# EAGLE design CortexPrint (EAGLE 6.4)
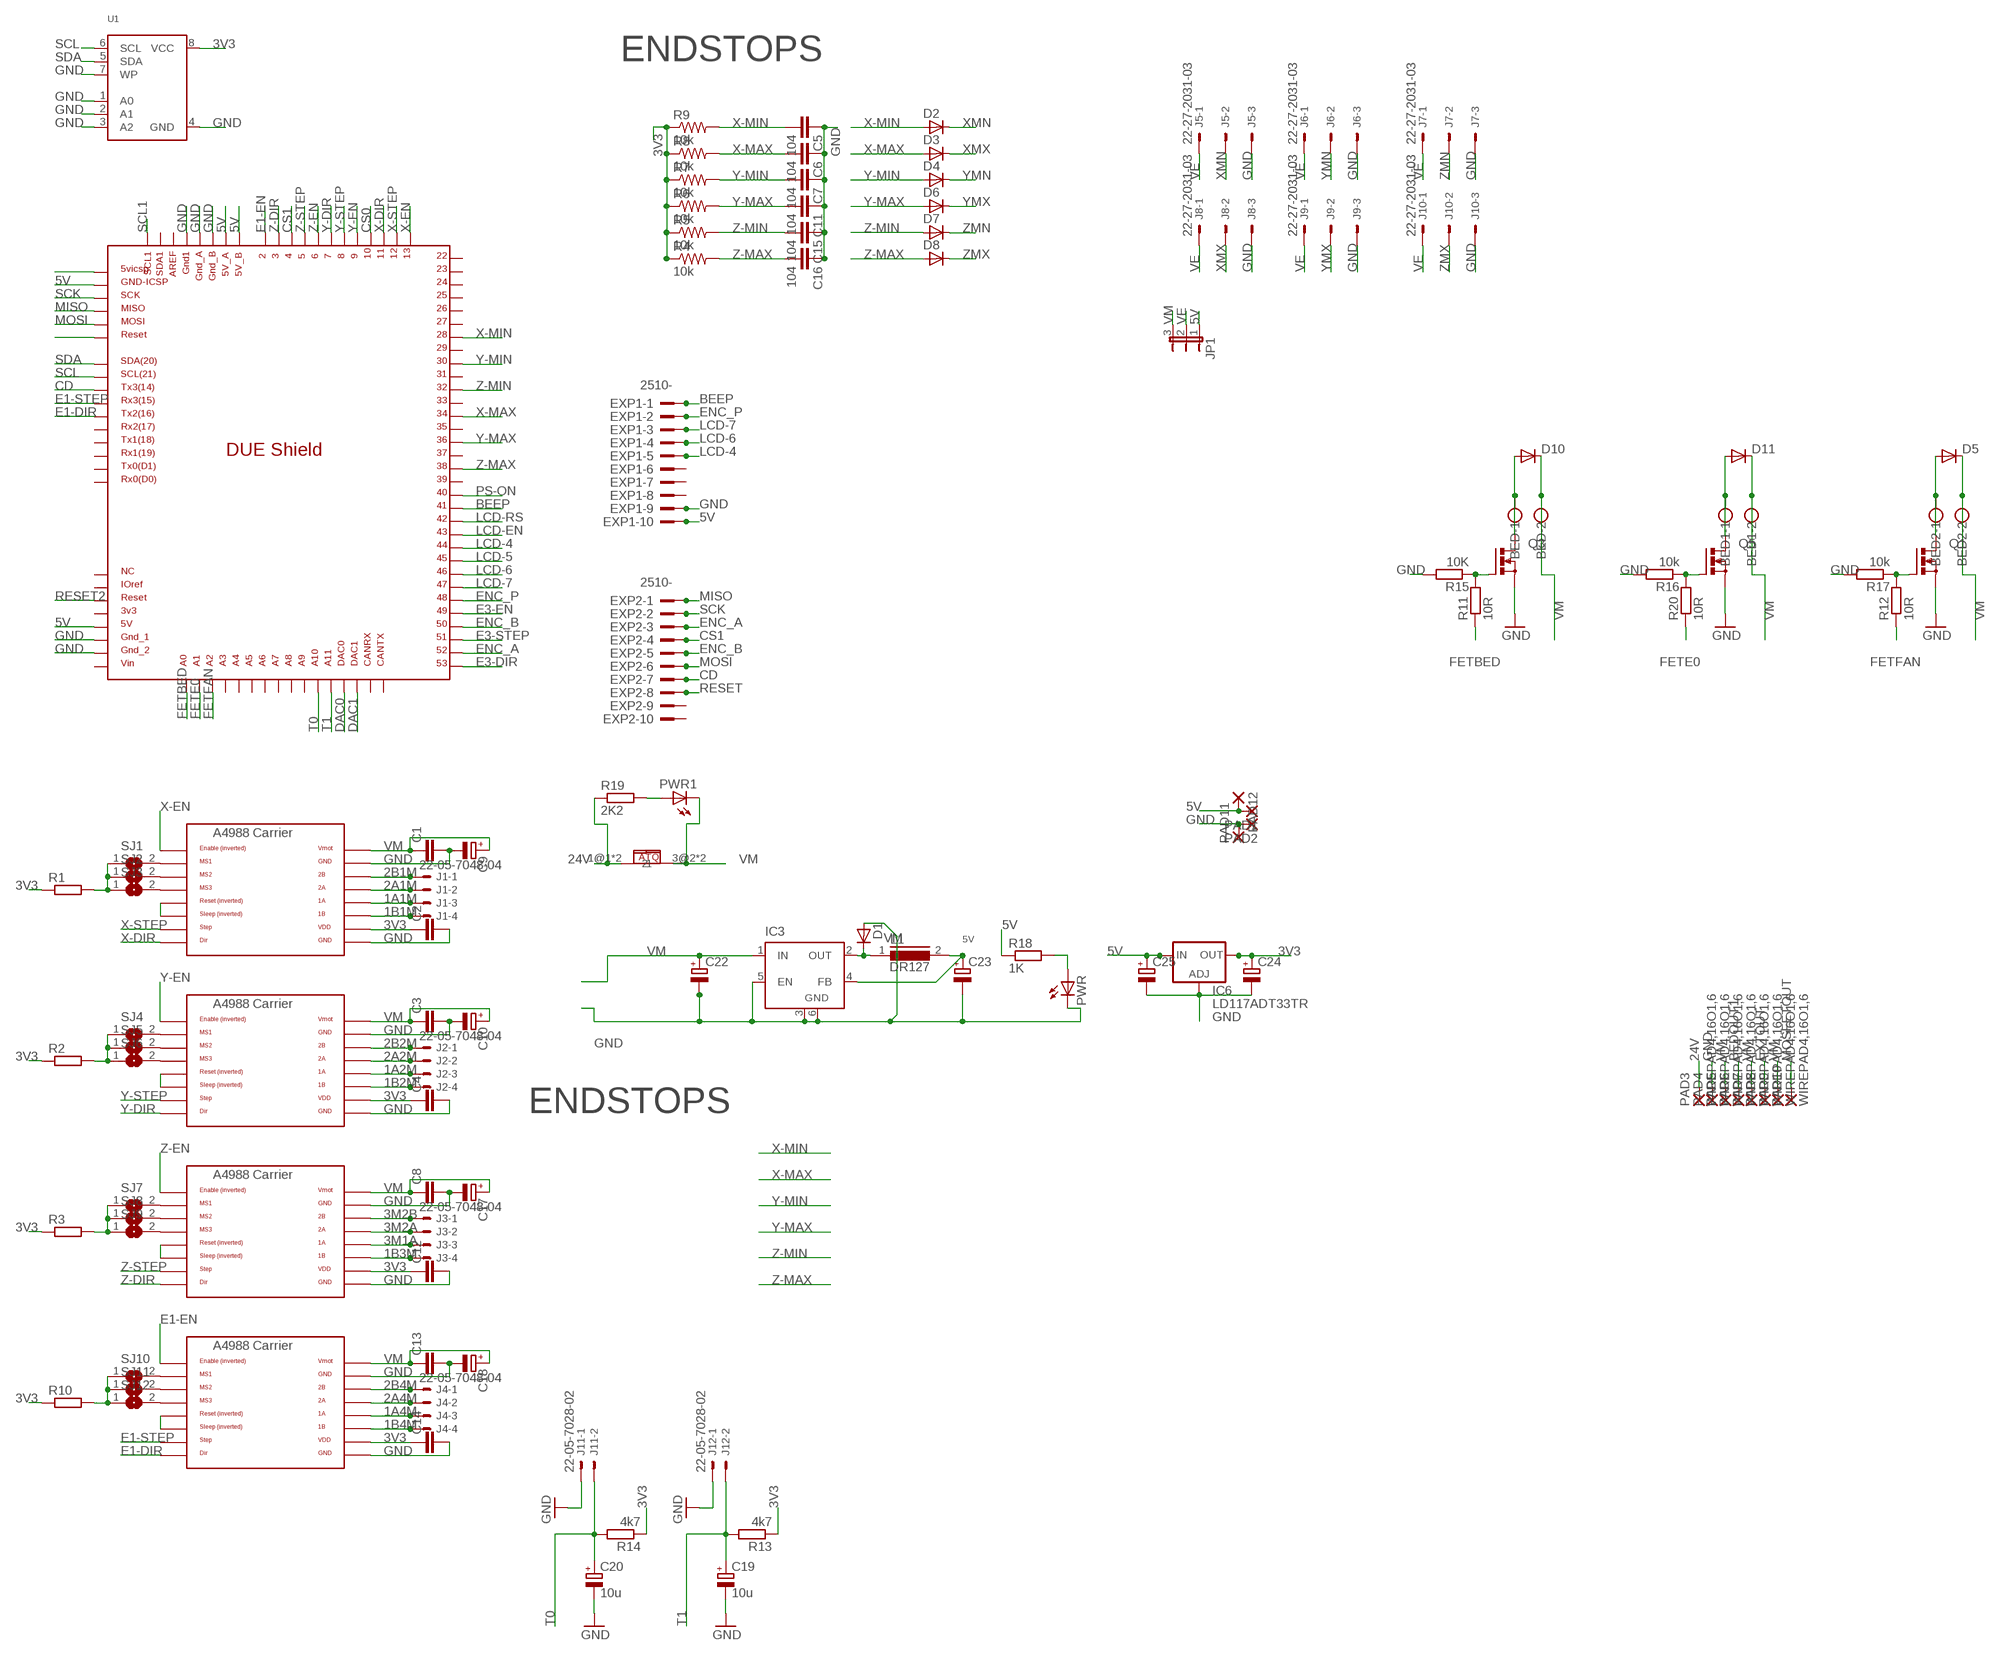
[diagram p0: schematic, sheet 1]

## Parts
BED  W237-102  [W237-102]
BED1  W237-102  [W237-102]
BED2  W237-102  [W237-102]
C1  C-EUC1206  [C1206]
C2  C-EUC1206  [C1206]
C3  C-EUC1206  [C1206]
C4  C-EUC1206  [C1206]
C5  104  C-EUC1206  [C1206]
C6  104  C-EUC1206  [C1206]
C7  104  C-EUC1206  [C1206]
C8  C-EUC1206  [C1206]
C9  CPOL-EUE2,5-6E  [E2,5-6E]
C10  CPOL-EUE2,5-6E  [E2,5-6E]
C11  104  C-EUC1206  [C1206]
C12  C-EUC1206  [C1206]
C13  C-EUC1206  [C1206]
C14  C-EUC1206  [C1206]
C15  104  C-EUC1206  [C1206]
C16  104  C-EUC1206  [C1206]
C17  CPOL-EUE2,5-6E  [E2,5-6E]
C18  CPOL-EUE2,5-6E  [E2,5-6E]
C19  10u  CPOL-EUSANYO_SMD_B6  [SANYO-OSCON_SMD_B6]
C20  10u  CPOL-EUSANYO_SMD_B6  [SANYO-OSCON_SMD_B6]
C22  CPOL-EUE  [PANASONIC_E]
C23  CPOL-EUE  [PANASONIC_E]
C24  CPOL-EUD  [PANASONIC_D]
C25  CPOL-EUD  [PANASONIC_D]
D1  D-SOD-87  [SOD87]
D2  D-SOD-87  [SOD87]
D3  D-SOD-87  [SOD87]
D4  D-SOD-87  [SOD87]
D5  DIODESMA-ALT  [SMA-DIODE_ALT]
D6  D-SOD-87  [SOD87]
D7  D-SOD-87  [SOD87]
D8  D-SOD-87  [SOD87]
D10  DIODESMA-ALT  [SMA-DIODE_ALT]
D11  DIODESMA-ALT  [SMA-DIODE_ALT]
EXP1  2510-  [PAK100/2500-10]
EXP2  2510-  [PAK100/2500-10]
IC3  LM2596S  [TO263-5]
IC6  LD117ADT33TR  [DPACK]
J1  22-05-7048-04  [7395-04]
J2  22-05-7048-04  [7395-04]
J3  22-05-7048-04  [7395-04]
J4  22-05-7048-04  [7395-04]
J5  22-27-2031-03  [6410-03]
J6  22-27-2031-03  [6410-03]
J7  22-27-2031-03  [6410-03]
J8  22-27-2031-03  [6410-03]
J9  22-27-2031-03  [6410-03]
J10  22-27-2031-03  [6410-03]
J11  22-05-7028-02  [7395-02]
J12  22-05-7028-02  [7395-02]
JP1  JP2E  [JP2]
L1  DR127  [DR127]
PAD1  3,81/1,4  [3,81/1,4]
PAD2  3,81/1,4  [3,81/1,4]
PAD3  WIREPAD4,16O1,6  [4,16O1,6]
PAD4  WIREPAD4,16O1,6  [4,16O1,6]
PAD5  WIREPAD4,16O1,6  [4,16O1,6]
PAD6  WIREPAD4,16O1,6  [4,16O1,6]
PAD7  WIREPAD4,16O1,6  [4,16O1,6]
PAD8  WIREPAD4,16O1,6  [4,16O1,6]
PAD9  WIREPAD4,16O1,6  [4,16O1,6]
PAD10  WIREPAD4,16O1,6  [4,16O1,6]
PAD11  3,81/1,4  [3,81/1,4]
PAD12  3,81/1,4  [3,81/1,4]
PWR  LEDCHIPLED_1206  [CHIPLED_1206]
PWR1  LEDCHIPLED_1206  [CHIPLED_1206]
Q1  PMOSFET_NTO220BV  [TO220BV]
Q3  PMOSFET_NTO220BV  [TO220BV]
Q5  PMOSFET_NTO220BV  [TO220BV]
R1  R-EU_0207/7  [0207/7]
R2  R-EU_0204/7  [0204/7]
R3  R-EU_0207/7  [0207/7]
R4  10k  R-US_M1206  [M1206]
R5  10k  R-US_M1206  [M1206]
R6  10k  R-US_M1206  [M1206]
R7  10k  R-US_M1206  [M1206]
R8  10k  R-US_M1206  [M1206]
R9  10k  R-US_M1206  [M1206]
R10  R-EU_0207/7  [0207/7]
R11  10R  R-EU_M1206  [M1206]
R12  10R  R-EU_M1206  [M1206]
R13  4k7  R-EU_M1206  [M1206]
R14  4k7  R-EU_M1206  [M1206]
R15  10K  R-EU_M1206  [M1206]
R16  10k  R-EU_M1206  [M1206]
R17  10k  R-EU_M1206  [M1206]
R18  1K  R-EU_M1206  [M1206]
R19  2K2  R-EU_M1206  [M1206]
R20  10R  R-EU_M1206  [M1206]
SJ1  SJ  [SJ]
SJ2  SJ  [SJ]
SJ3  SJ  [SJ]
SJ4  SJ  [SJ]
SJ5  SJ  [SJ]
SJ6  SJ  [SJ]
SJ7  SJ  [SJ]
SJ8  SJ  [SJ]
SJ9  SJ  [SJ]
SJ10  SJ  [SJ]
SJ11  SJ  [SJ]
SJ12  SJ  [SJ]
U1  EEPROM_I2C_SOIC8_GENERIC  [SOIC8_150MIL]
U$1  DUE(NORMAL)  [DUE(NORMAL)]
U$2  POLOLU_A4983CARRIER  [A4988BREAKOUT]
U$3  POLOLU_A4983CARRIER  [A4988BREAKOUT]
U$4  POLOLU_A4983CARRIER  [A4988BREAKOUT]
U$5  POLOLU_A4983CARRIER  [A4988BREAKOUT]
U$7  CQ-121  [CQ121]

## Nets
1A1M: J1.3 U$2.1A
1A2M: J2.3 U$3.1A
1A4M: J4.3 U$5.1A
1B1M: J1.4 U$2.1B
1B2M: J2.4 U$3.1B
1B3M: J3.4 U$4.1B
1B4M: J4.4 U$5.1B
2A1M: J1.2 U$2.2A
2A2M: J2.2 U$3.2A
2A4M: J4.2 U$5.2A
2B1M: J1.1 U$2.2B
2B2M: J2.1 U$3.2B
2B4M: J4.1 U$5.2B
3M1A: J3.3 U$4.1A
3M2A: J3.2 U$4.2A
3M2B: J3.1 U$4.2B
3V3: C2.1 C4.1 C12.1 C14.1 C24.+ IC6.4(OUT) R1.1 R2.1 R3.1 R4.1 R5.1 R6.1 R7.1 R8.1 R9.1 R10.1 R13.1 R14.1 U1.8(VCC) U$2.VDD U$3.VDD U$4.VDD U$5.VDD
5V: C23.+ C25.+ EXP1.10 IC3.4(FB) IC6.3(IN) JP1.1 L1.2 PAD1.1(P) PAD12.1(P) R18.1 U$1.5V-P(5V) U$1.5V_A U$1.5V_B U$1.GND_ICSP
24V: PAD3.1(P) R19.1 U$7.1@1 U$7.2@1
BEDOUT1: BED.1 D10.A PAD6.1(P) Q3.D
BEEP: EXP1.1 U$1.41
CD: EXP2.7 U$1.TX3
CS0: U$1.10
CS1: EXP2.4 U$1.4
DAC0: U$1.DAC0
DAC1: U$1.DAC1
E1-DIR: U$1.TX2 U$5.DIR
E1-EN: U$1.2 U$5.EN
E1-STEP: U$1.RX3 U$5.STEP
E3-DIR: U$1.53
E3-EN: U$1.49
E3-STEP: U$1.51
ENC_A: EXP2.3 U$1.52
ENC_B: EXP2.5 U$1.50
ENC_P: EXP1.2 U$1.48
EXTOUT: BED1.1 D11.A PAD8.1(P) Q5.D
FETBED: R11.1 U$1.A0
FETE0: R20.1 U$1.A1
FETFAN: R12.1 U$1.A2
GND: C1.2 C2.2 C3.2 C4.2 C5.1 C6.1 C7.1 C8.2 C9.- C10.- C11.1 C12.2 C13.2 C14.2 C15.1 C16.1 C17.- C18.- C19.- C20.- C22.- C23.- C24.- C25.- D1.2(A) EXP1.9 IC3.3(GND) IC3.5(EN) IC3.6(GND) IC6.1(ADJ) J5.3 J6.3 J7.3 J8.3 J9.3 J10.3 J11.1 J12.1 PAD2.1(P) PAD4.1(P) PAD11.1(P) PWR.C Q1.S Q3.S Q5.S R15.2 R16.2 R17.2 U1.1(A0) U1.2(A1) U1.3(A2) U1.4(GND) U1.7(WP) U$1.GND1 U$1.GND_1 U$1.GND_2 U$1.GND_A U$1.GND_B U$2.GND U$2.GND@0(GND) U$3.GND U$3.GND@0(GND) U$4.GND U$4.GND@0(GND) U$5.GND U$5.GND@0(GND)
LCD-4: EXP1.5 U$1.44
LCD-5: U$1.45
LCD-6: EXP1.4 U$1.46
LCD-7: EXP1.3 U$1.47
LCD-EN: U$1.43
LCD-RS: U$1.42
MISO: EXP2.1 U$1.MISO_ICSP
MOSFETOUT: BED2.1 D5.A PAD10.1(P) Q1.D
MOSI: EXP2.6 U$1.MOSI_ICSP
N$1: U$1.5V_ICSP
N$2: Q1.G R12.2 R17.1
N$10: D1.1(C) IC3.2(OUT) L1.1
N$17: PWR1.A R19.2
N$18: U$3.RST U$3.SLP(SLEEP)
N$25: SJ4.2 U$3.MS1
N$26: SJ1.2 U$2.MS1
N$27: SJ2.2 U$2.MS2
N$28: SJ3.2 U$2.MS3
N$29: R1.2 SJ1.1 SJ2.1 SJ3.1
N$30: SJ5.2 U$3.MS2
N$31: SJ6.2 U$3.MS3
N$32: R2.2 SJ4.1 SJ5.1 SJ6.1
N$33: U$4.RST U$4.SLP(SLEEP)
N$34: SJ7.2 U$4.MS1
N$35: U$2.RST U$2.SLP(SLEEP)
N$36: SJ8.2 U$4.MS2
N$37: SJ9.2 U$4.MS3
N$38: R3.2 SJ7.1 SJ8.1 SJ9.1
N$39: U$5.RST U$5.SLP(SLEEP)
N$40: SJ10.2 U$5.MS1
N$41: SJ11.2 U$5.MS2
N$42: SJ12.2 U$5.MS3
N$43: R10.2 SJ10.1 SJ11.1 SJ12.1
N$44: PWR.A R18.2
N$46: Q5.G R16.1 R20.2
N$67: Q3.G R11.2 R15.1
PS-ON: U$1.40
RESET: EXP2.8 U$1.RESET_ICSP
RESET2: U$1.RESET
SCK: EXP2.2 U$1.SCK_ICSP
SCL: U1.6(SCL) U$1.SCL
SCL1: U$1.SCL1
SDA: U1.5(SDA) U$1.SDA
T0: C20.+ J11.2 R14.2 U$1.A10
T1: C19.+ J12.2 R13.2 U$1.A11
VE: J5.1 J6.1 J7.1 J8.1 J9.1 J10.1 JP1.2
VM: BED1.2 BED2.2 BED.2 C1.1 C3.1 C8.1 C9.+ C10.+ C13.1 C17.+ C18.+ C22.+ D5.C D10.C D11.C IC3.1(IN) JP1.3 PAD5.1(P) PAD7.1(P) PAD9.1(P) PWR1.C U$2.VMOT U$3.VMOT U$4.VMOT U$5.VMOT U$7.3@2 U$7.4@2
X-DIR: U$1.11 U$2.DIR
X-EN: U$1.13 U$2.EN
X-MAX: C6.2 D3.2(A) R8.2 U$1.34
X-MIN: C5.2 D2.2(A) R9.2 U$1.28
X-STEP: U$1.12 U$2.STEP
XMN: D2.1(C) J5.2
XMX: D3.1(C) J8.2
Y-DIR: U$1.7 U$3.DIR
Y-EN: U$1.9 U$3.EN
Y-MAX: C11.2 D6.2(A) R6.2 U$1.36
Y-MIN: C7.2 D4.2(A) R7.2 U$1.30
Y-STEP: U$1.8 U$3.STEP
YMN: D4.1(C) J6.2
YMX: D6.1(C) J9.2
Z-DIR: U$1.3 U$4.DIR
Z-EN: U$1.6 U$4.EN
Z-MAX: C16.2 D8.2(A) R4.2 U$1.38
Z-MIN: C15.2 D7.2(A) R5.2 U$1.32
Z-STEP: U$1.5 U$4.STEP
ZMN: D7.1(C) J7.2
ZMX: D8.1(C) J10.2
Unconnected: EXP1.6 EXP1.7 EXP1.8 EXP2.9 EXP2.10 U$1.3V3 U$1.22 U$1.23 U$1.24 U$1.25 U$1.26 U$1.27 U$1.29 U$1.31 U$1.33 U$1.35 U$1.37 U$1.39 U$1.A3 U$1.A4 U$1.A5 U$1.A6 U$1.A7 U$1.A8 U$1.A9 U$1.AREF U$1.CANRX U$1.CANTX U$1.IOREF U$1.NC U$1.RX0 U$1.RX1 U$1.RX2 U$1.SDA1 U$1.TX0 U$1.TX1 U$1.VIN

## Notes on the sheet
- ENDSTOPS
- BLUE=ALL-OK LOGIC
- 1
- 1 | 1 | 1
- 1 | 1 | 1
- 0
- 1
- 1 | 1 | 1
- 1 | 1 | 0
- 1
- 1
- 1
- 1 | 1
- 1 | 0
- 1
- 1
- LED
- 1 | 1
- ENDSTOPS

## Library data of the parts
BED BED1 BED2 = con-wago-500:W237-102: WAGO SCREW CLAMP; MPN: 237-102; OC_FARNELL: unknown; OC_NEWARK: 70K9898
C1-C8 C11-C16 = rcl:C-EU: CAPACITOR, European symbol
C9 C10 C17-C20 C24 C25 = rcl:CPOL-EU: POLARIZED CAPACITOR, European symbol
C22 C23 = resistor:CPOL-EU: POLARIZED CAPACITOR, European symbol
D1-D4 D6-D8 = semicon-smd-ipc:D-: DIODE unfilled
D5 D10 D11 = SparkFun-DiscreteSemi:DIODE: Diode These are standard reverse protection diodes and small signal diodes. SMA package can handle up to about 1A. SOD-323 can handle about 200mA. What the SOD-323 package when ordering, there are some mfgs out there that are 5-pin packages.
EXP1 EXP2 = con-3m:2510-: 3M (TM) Pak 100 4-Wall Header Source: 3M; MF: 3M; MPN: 2510-6002UB; OC_FARNELL: 9838244; OC_NEWARK: 46F4725
IC3 = linear:LM2596S: STEP-DOWN VOLTAGE REGULATOR
IC6 = v-reg:LD117A?*: Low drop fixed and adjustable positive voltage regulators 1 A Source: http://www.st.com/stonline/products/literature/ds/7194/ld1117axx.pdf
J1-J4 = con-molex:22-?-04: CONNECTOR wire to board 2.54 mm (.1 inch) pitch header; OC_FARNELL: unknown; OC_NEWARK: unknown
J5-J10 = con-molex:22-?-03: CONNECTOR wire to board 2.54 mm (.1 inch) pitch header; OC_FARNELL: unknown; OC_NEWARK: unknown
J11 J12 = con-molex:22-?-02: CONNECTOR wire to board 2.54 mm (.1 inch) pitch header; OC_FARNELL: 9731601; OC_NEWARK: unknown
JP1 = jumper:JP2E: JUMPER
L1 = inductors:DR127: High Power Density, High Efficiency, Shielded Inductors Source: coiltronics_dr_series.pdf
PAD1 PAD2 PAD11 PAD12 = wirepad:3,81/1,4: THROUGH-HOLE PAD
PAD3-PAD10 = wirepad:WIREPAD: Wire PAD connect wire on PCB
PWR PWR1 = RepRapjr:LED: LED OSRAM: - CHIPLED LG R971, LG N971, LY N971, LG Q971, LY Q971, LO R971, LY R971 LH N974, LH R974 LS Q976, LO Q976, LY Q976 LO Q996 - Hyper CHIPLED LW Q18S LB Q993, LB Q99A, LB R99A - SideLED LS A670, LO A670, LY A670, LG A670, LP A670 LB A673, LV A673, LT A673, LW A673 LH A674 LY A675 LS A676, LA A676, LO A676, LY A676, LW A676 LS A679, LY A679, LG A679 - Hyper Micro SIDELED® LS Y876, LA Y876, LO Y876, LY Y876 LT Y87S - SmartLED LW L88C, LW L88S LB L89C, LB L89S, LG L890 LS L89K, LO L89K, LY L89K LS L896, LA L896, LO L896, LY L896 - TOPLED LS T670, LO T670, LY T670, LG T670, LP T670 LSG T670, LSP T670, LSY T670, LOP T670, LYG T670 LG T671, LOG T671, LSG T671 LB T673, LV T673, LT T673, LW T673 LH T674 LS T676, LA T676, LO T676, LY T676, LB T676, LH T676, LSB T676, LW T676 LB T67C, LV T67C, LT T67C, LS T67K, LO T67K, LY T67K, LW E67C LS E67B, LA E67B, LO E67B, LY E67B, LB E67C, LV E67C, LT E67C LW T67C LS T679, LY T679, LG T679 LS T770, LO T770, LY T770, LG T770, LP T770 LB T773, LV T773, LT T773, LW T773 LH T774 LS E675, LA E675, LY E675, LS T675 LS T776, LA T776, LO T776, LY T776, LB T776 LHGB T686 LT T68C, LB T68C - Hyper Mini TOPLED® LB M676 - Mini TOPLED Santana® LG M470 LS M47K, LO M47K, LY M47K Source: http://www.osram.convergy.de LUXEON: - LUMILED® LXK2-PW12-R00, LXK2-PW12-S00, LXK2-PW14-U00, LXK2-PW14-V00 LXK2-PM12-R00, LXK2-PM12-S00, LXK2-PM14-U00 LXK2-PE12-Q00, LXK2-PE12-R00, LXK2-PE12-S00, LXK2-PE14-T00, LXK2-PE14-U00 LXK2-PB12-K00, LXK2-PB12-L00, LXK2-PB12-M00, LXK2-PB14-N00, LXK2-PB14-P00, LXK2-PB14-Q00 LXK2-PR12-L00, LXK2-PR12-M00, LXK2-PR14-Q00, LXK2-PR14-R00 LXK2-PD12-Q00, LXK2-PD12-R00, LXK2-PD12-S00 LXK2-PH12-R00, LXK2-PH12-S00 LXK2-PL12-P00, LXK2-PL12-Q00, LXK2-PL12-R00 Source: www.luxeon.com KINGBRIGHT: KA-3528ASYC Source: www.kingbright.com
Q1 Q3 Q5 = transistor-power:PMOSFET_N: Power MOSFET N-Channel
R1-R3 R10 R18 R19 = rcl:R-EU_: RESISTOR, European symbol
R4-R9 = adafruit:R-US_: RESISTOR, American symbol
R11-R17 R20 = resistor:R-EU_: RESISTOR, European symbol
SJ1-SJ12 = jumper:SJ: SMD solder JUMPER
U1 = microbuilder:EEPROM_I2C_SOIC8_GENERIC: Note: The same pinout is used for many I2C EEPROMs in SOIC8(150mil) from a variety of manufacturers and in various sizes. Examples: 16K (2K x 8 Bit) I2C EEPROM 1.7-5.5V, 400KHz, -40°C-85°C Digikey: CAT24C16WI-GT3CT-ND 256K (32K x 8 Bit) I2C EEPROM 1.7-5.5V, 400KHz, -40°C-85°C Digikey: 24AA256-I/SN-ND
U$1 = DUElib130425:DUE(NORMAL)
U$2-U$5 = RepRapjr:POLOLU_A4983CARRIER
U$7 = Mantech.co.za:CQ-121

## Board
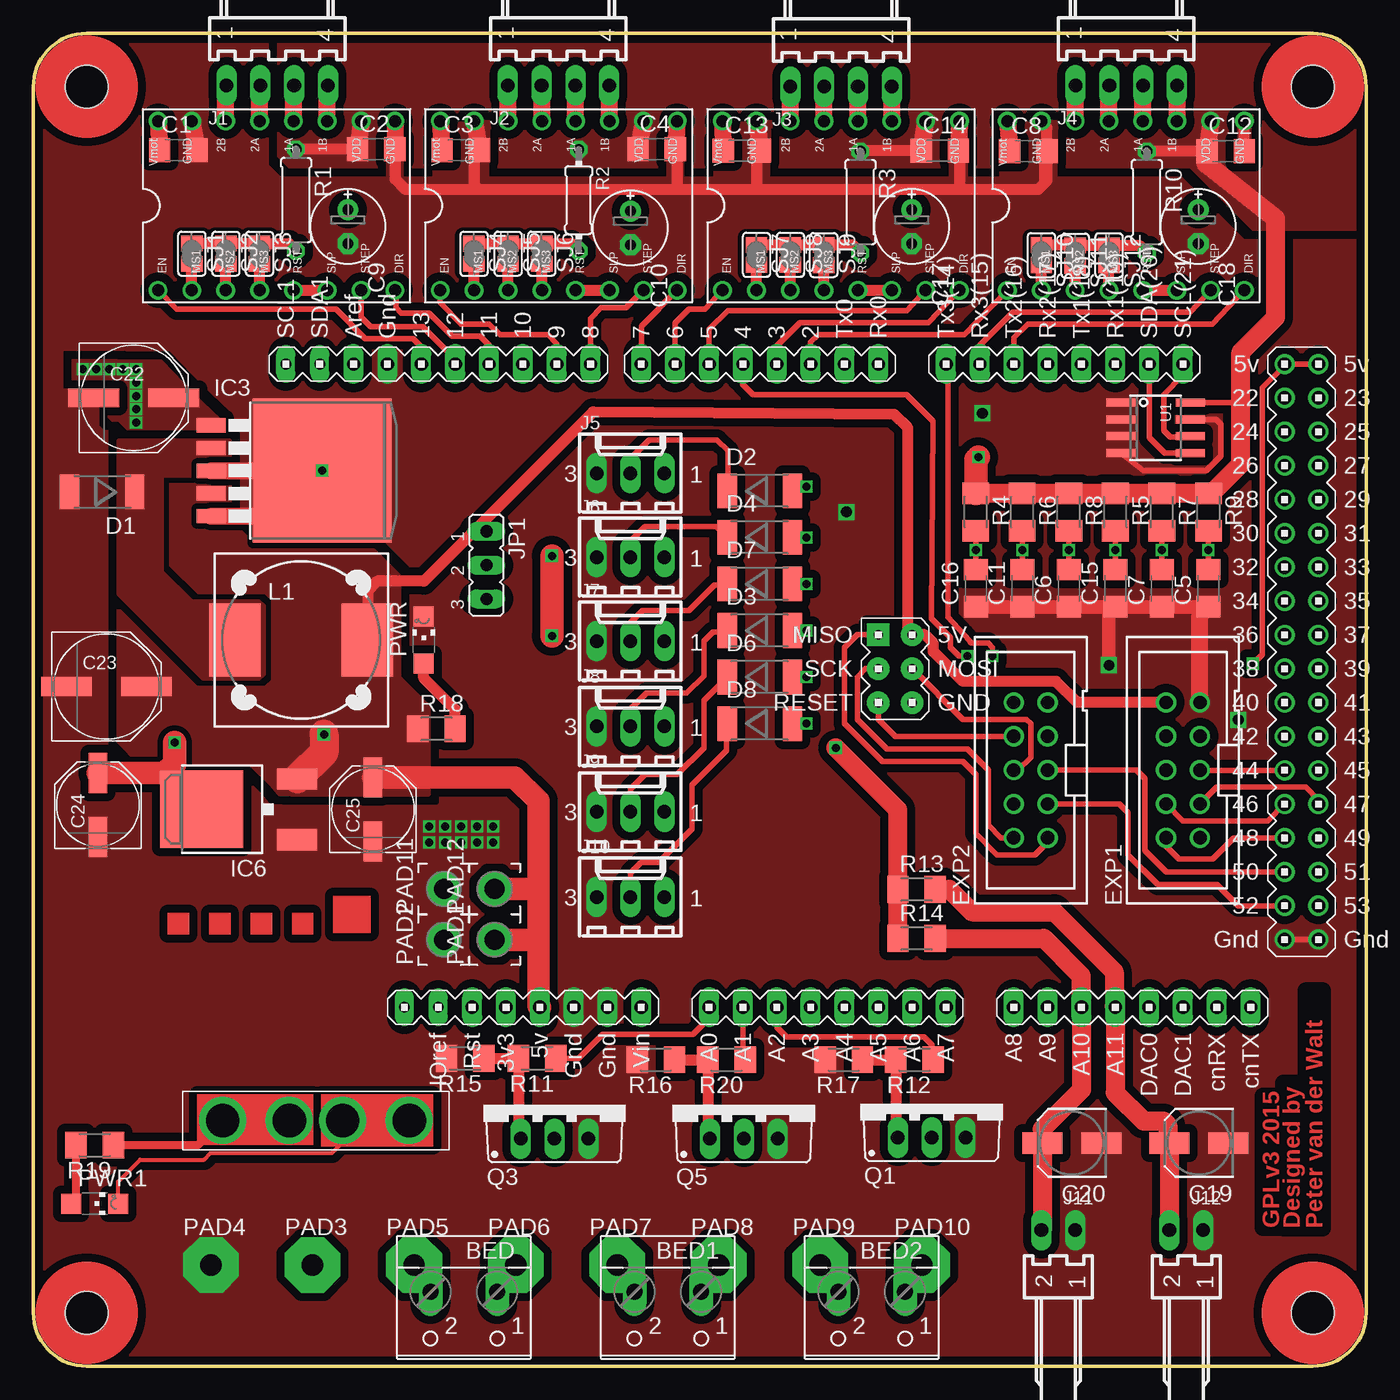
[diagram p1: board, top side]
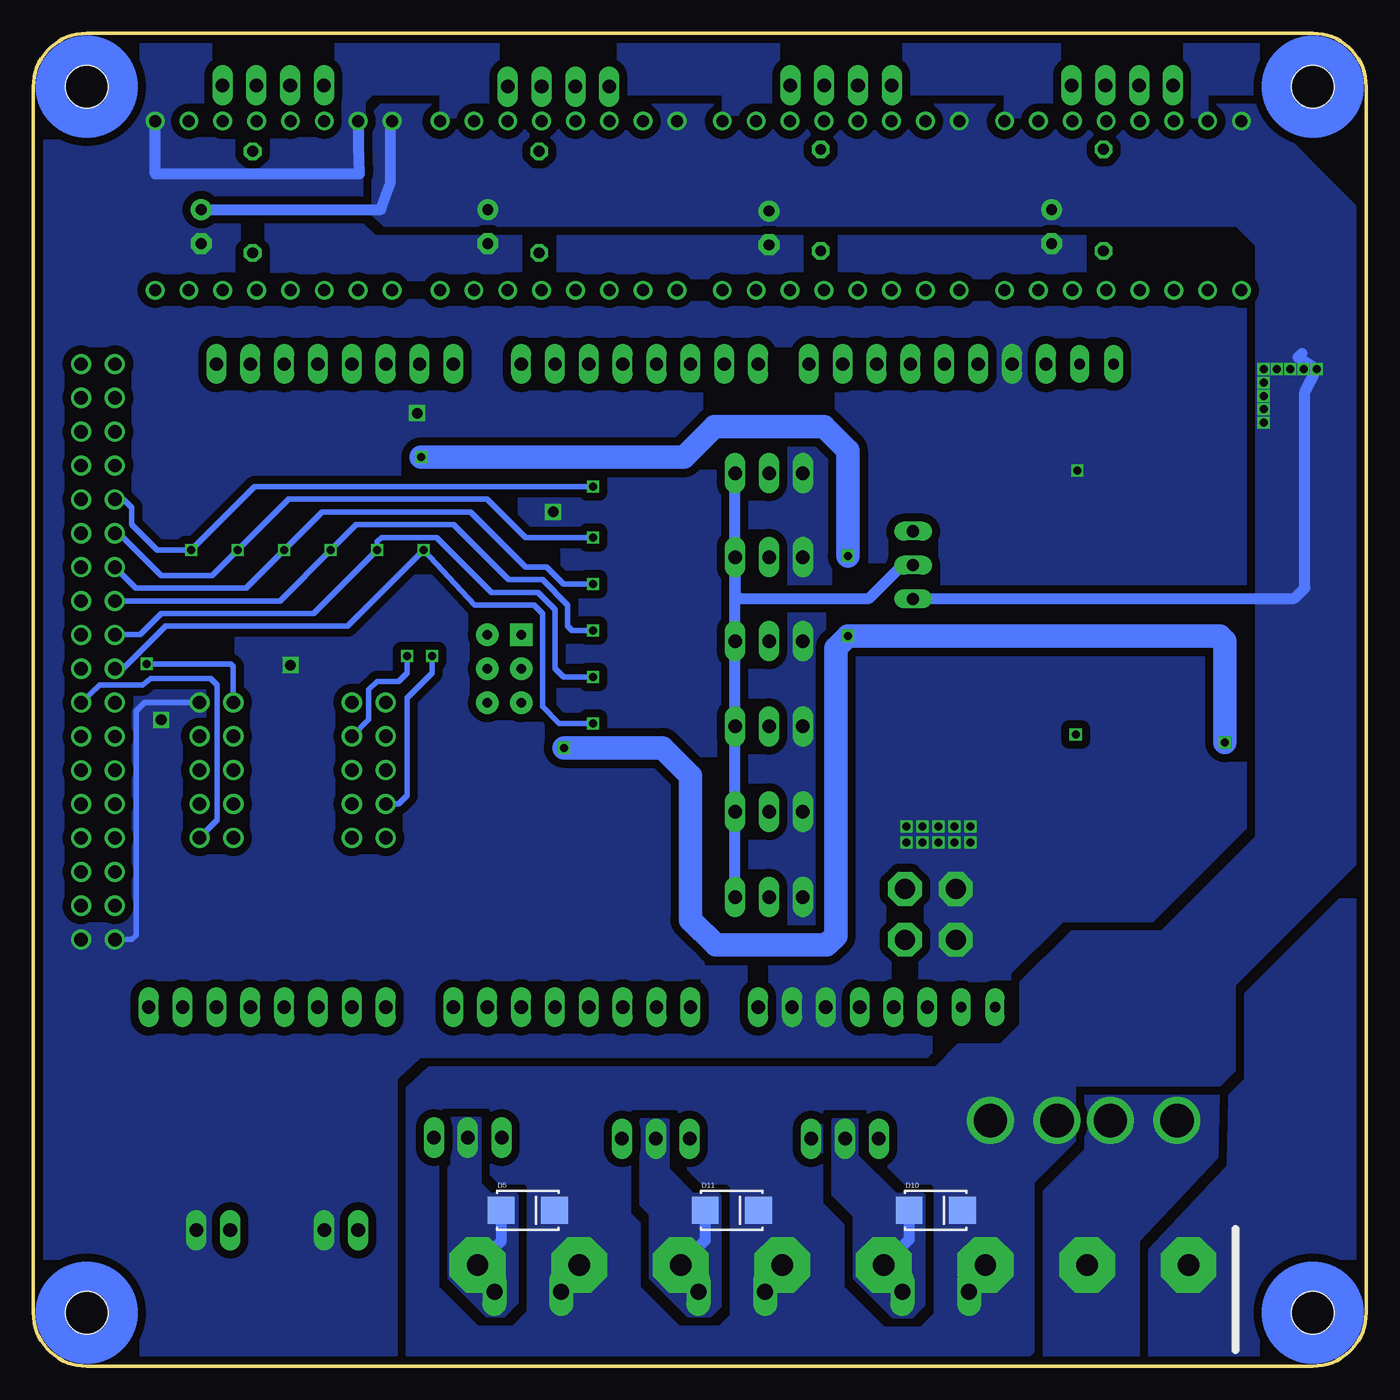
[diagram p2: board, bottom side, seen from below]

Size 100 x 100 mm. Coordinates in mm from the lower left corner, seen from the top.
Outline: 100,96 100,4 arc-90 96,0 4,0 arc-90 0,4 0,96 arc-90 4,100 96,100 arc-90 100,96
Copper layers (1*16): Top 0.035mm / dielectric 1.5mm / Bottom 0.035mm
Design rules "dirt_cheap_dirty_boards.v1": minimum track width 5mil, minimum drill 12mil, track to track 5mil, track to pad 5mil, pad to pad 5mil, via to via 5mil, smd to smd 0mil, copper to edge 10mil, drill to drill 10mil, minimum pad ring 10mil, minimum via ring 6mil, stop-mask expansion 2mil, vias tented up to drill 25mil, thermal gap 10mil
Holes 3.2 mm at 4,96 96,96 96,4 4,4

### Footprints (pad centres in the part's own frame; a part is rotated, then mirrored left to right if it is on the bottom)
W237-102 = drill 1.194 long: 1 -2.5,-1.27; 2 2.5,-1.27
C1206 = smd 1.6 x 1.8: 1 -1.4,0; 2 1.4,0
E2,5-6E = drill 0.813 pad 1.575: + -1.27,0 | drill 0.813 pad 1.575 octagon: - 1.27,0
SANYO-OSCON_SMD_B6 = smd 3 x 1.6: + 2.2,0; - -2.2,0
PANASONIC_E = smd 3.8 x 1.4: + 3,0; - -3,0
PANASONIC_D = smd 3 x 1.4: + 2.4,0; - -2.4,0
SOD87 = smd 1.45 x 2.6: 1 -2.445,0; 2 2.445,0
SMA-DIODE_ALT = smd 2 x 2: A -2,0; C 2,0
PAK100/2500-10 = drill 1 pad 1.422: 1 -5.08,-1.27; 2 -5.08,1.27; 3 -2.54,-1.27; 4 -2.54,1.27; 5 0,-1.27; 6 0,1.27; 7 2.54,-1.27; 8 2.54,1.27; 9 5.08,-1.27; 10 5.08,1.27
TO263-5 = smd 1.067 x 2.159: 1 -3.404,-5.791; 2 -1.702,-5.791; 3 0,-5.791; 4 1.702,-5.791; 5 3.404,-5.791 | smd 10.8 x 10.41: 6 0,2.54
DPACK = smd 1.6 x 3: 1 -2.28,-4.8; 3 2.28,-4.8 | smd 5.8 x 6.2: 4 0,2.38
7395-04 = drill 1.016 long: 1 3.81,0; 2 1.27,0; 3 -1.27,0; 4 -3.81,0
6410-03 = drill 1.016 long: 1 2.54,0; 2 0,0; 3 -2.54,0
7395-02 = drill 1.016 long: 1 1.27,0; 2 -1.27,0
JP2 = drill 0.914 long: 1 -2.54,0; 2 0,0; 3 2.54,0
DR127 = smd 3.85 x 5.5: 1 -4.975,0; 2 4.975,0
3,81/1,4 = drill 1.5 pad 2.54 octagon: 1 0,0
4,16O1,6 = drill 1.6 pad 4.166 octagon: 1 0,0
CHIPLED_1206 = smd 1.5 x 1.5: A 0,-1.75; C 0,1.75
TO220BV = drill 1.016 long: D 0,-2.54; G -2.54,-2.54; S 2.54,-2.54
0207/7 = drill 0.813 octagon: 1 -3.81,0; 2 3.81,0
0204/7 = drill 0.813 octagon: 1 -3.81,0; 2 3.81,0
M1206 = smd 1.6 x 2: 1 -1.4,0; 2 1.4,0
SJ = smd 1.168 x 1.6: 1 -0.762,0; 2 0.762,0
SOIC8_150MIL = smd 0.6 x 2.2: 1 -1.905,-2.6; 2 -0.635,-2.6; 3 0.635,-2.6; 4 1.905,-2.6; 5 1.905,2.6; 6 0.635,2.6; 7 -0.635,2.6; 8 -1.905,2.6
DUE(NORMAL) = drill 1 long: 2 -16.51,30.48; 3 -19.05,30.48; 3V3 -39.37,-17.78; 4 -21.59,30.48; 5 -24.13,30.48; 5V-P -36.83,-17.78; 6 -26.67,30.48; 7 -29.21,30.48; 8 -33.02,30.48; 9 -35.56,30.48; 10 -38.1,30.48; 11 -40.64,30.48; 12 -43.18,30.48; 13 -45.72,30.48; A0 -24.13,-17.78; A1 -21.59,-17.78; A2 -19.05,-17.78; A3 -16.51,-17.78; A4 -13.97,-17.78; A5 -11.43,-17.78; A6 -8.89,-17.78; A7 -6.35,-17.78; A8 -1.27,-17.78; A9 1.27,-17.78; A10 3.81,-17.78; A11 6.35,-17.78; AREF -50.8,30.48; CANRX 13.97,-17.78; CANTX 16.51,-17.78; DAC0 8.89,-17.78; DAC1 11.43,-17.78; GND1 -48.26,30.48; GND_1 -34.29,-17.78; GND_2 -31.75,-17.78; RESET -41.91,-17.78; RX0 -11.43,30.48; RX1 6.35,30.48; RX2 1.27,30.48; RX3 -3.81,30.48; SCL 11.43,30.48; SDA 8.89,30.48; TX0 -13.97,30.48; TX1 3.81,30.48; TX2 -1.27,30.48; TX3 -6.35,30.48; VIN -29.21,-17.78 | drill 1: 5V_A 19.05,30.48; 5V_B 21.59,30.48; 22 19.05,27.94; 23 21.59,27.94; 24 19.05,25.4; 25 21.59,25.4; 26 19.05,22.86; 27 21.59,22.86; 28 19.05,20.32; 29 21.59,20.32; 30 19.05,17.78; 31 21.59,17.78; 32 19.05,15.24; 33 21.59,15.24; 34 19.05,12.7; 35 21.59,12.7; 36 19.05,10.16; 37 21.59,10.16; 38 19.05,7.62; 39 21.59,7.62; 40 19.05,5.08; 41 21.59,5.08; 42 19.05,2.54; 43 21.59,2.54; 44 19.05,0; 45 21.59,0; 46 19.05,-2.54; 47 21.59,-2.54; 48 19.05,-5.08; 49 21.59,-5.08; 50 19.05,-7.62; 51 21.59,-7.62; 52 19.05,-10.16; 53 21.59,-10.16; GND_A 19.05,-12.7; GND_B 21.59,-12.7 | drill 0.7 pad 1.676: 5V_ICSP -8.89,5.08; GND_ICSP -8.89,10.16; MOSI_ICSP -8.89,7.62; RESET_ICSP -11.43,5.08; SCK_ICSP -11.43,7.62 | drill 0.8 pad 1.422 long: IOREF -44.45,-17.78; NC -46.99,-17.78; SCL1 -55.88,30.48; SDA1 -53.34,30.48 | drill 0.7 pad 1.676 square: MISO_ICSP -11.43,10.16
A4988BREAKOUT = drill 0.9: 1A 8.89,1.27; 1B 11.43,1.27; 2A 6.35,1.27; 2B 3.81,1.27; DIR 16.51,-11.43; EN -1.27,-11.43; GND 16.51,1.27; GND@0 1.27,1.27; MS1 1.27,-11.43; MS2 3.81,-11.43; MS3 6.35,-11.43; RST 8.89,-11.43; SLP 11.43,-11.43; STEP 13.97,-11.43; VDD 13.97,1.27; VMOT -1.27,1.27
CQ121 = drill 2.5: 1@1 -7,0; 2@1 -2,0; 3@2 2,0; 4@2 7,0

### Placement (x,y rotation side)
BED  32.3,4.3 180 top
BED1  47.6,4.3 180 top
BED2  62.9,4.3 180 top
C1  10.88,91.25 0 top
C2  25.73,91.3 0 top
C3  32.07,91.25 0 top
C4  46.77,91.3 0 top
C5  88.17,58.37 90 top
C6  77.69,58.37 90 top
C7  84.67,58.37 90 top
C8  74.65,91.15 0 top
C9  23.6,85.5 270 top
C10  44.8,85.4 270 top
C11  74.19,58.37 90 top
C12  89.45,91.15 0 top
C13  53.16,91.2 0 top
C14  68.01,91.2 0 top
C15  81.18,58.37 90 top
C16  70.7,58.37 90 top
C17  65.9,85.5 270 top
C18  87.4,85.5 270 top
C19  87.44,16.75 180 top
C20  77.91,16.75 180 top
C22  7.54,72.64 0 top
C23  5.48,50.99 0 top
C24  4.85,42.1 90 top
C25  25.48,41.78 90 top
D1  5.17,65.59 180 top
D2  54.51,65.67 0 top
D3  54.51,55.2 0 top
D4  54.51,62.18 0 top
D5  62.9,11.7 0 bottom
D6  54.51,51.7 0 top
D7  54.51,58.69 0 top
D8  54.51,48.21 0 top
D10  32.3,11.7 0 bottom
D11  47.6,11.7 0 bottom
EXP1  86.26,44.72 90 top
EXP2  74.83,44.72 90 top
IC3  19.14,67.18 270 top
IC6  15.01,41.78 90 top
J1  18.3,96.1 180 top
J2  39.4,96.1 180 top
J3  60.6,96 180 top
J4  82,96.1 180 top
J5  44.8,67 0 top
J6  44.8,60.7 0 top
J7  44.8,54.4 0 top
J8  44.8,48 0 top
J9  44.8,41.6 0 top
J10  44.8,35.2 0 top
J11  76.9,10.2 0 top
J12  86.5,10.2 0 top
JP1  34,60.1 270 top
L1  20.09,54.48 0 top
PAD1  34.6,32 90 top
PAD2  30.8,32 90 top
PAD3  20.95,7.6 0 top
PAD4  13.33,7.6 0 top
PAD5  28.57,7.6 0 top
PAD6  36.19,7.6 0 top
PAD7  43.81,7.6 0 top
PAD8  51.43,7.6 0 top
PAD9  59.05,7.6 0 top
PAD10  66.67,7.6 0 top
PAD11  30.8,35.8 90 top
PAD12  34.6,35.8 90 top
PWR  29.3,54.48 0 top
PWR1  4.6,12.2 270 top
Q1  67.4,19.7 0 top
Q3  39.1,19.6 0 top
Q5  53.3,19.6 0 top
R1  19.71,87.49 270 top
R2  40.92,87.48 270 top
R3  62.05,87.34 270 top
R4  70.7,64.09 270 top
R5  81.18,64.09 270 top
R6  74.19,64.09 270 top
R7  84.67,64.09 270 top
R8  77.69,64.09 270 top
R9  88.17,64.09 270 top
R10  83.54,87.34 270 top
R11  37.8,23.1 180 top
R12  66.1,23 180 top
R13  66.26,35.77 0 top
R14  66.26,32.09 0 top
R15  32.4,23.1 180 top
R16  46.7,23 180 top
R17  60.8,23 180 top
R18  30.25,47.81 0 top
R19  4.6,16.59 180 top
R20  52,23 180 top
SJ1  11.89,83.47 270 top
SJ2  14.45,83.47 270 top
SJ3  16.96,83.47 270 top
SJ4  33.06,83.46 270 top
SJ5  35.62,83.47 270 top
SJ6  38.14,83.47 270 top
SJ7  54.26,83.38 270 top
SJ8  56.8,83.38 270 top
SJ9  59.3,83.37 270 top
SJ10  75.63,83.37 270 top
SJ11  78.16,83.33 270 top
SJ12  80.7,83.34 270 top
U1  84.2,70.4 270 top
U$1  74.83,44.71 0 top
U$2  10.62,92.15 0 top
U$3  31.8,92.15 0 top
U$4  52.98,92.15 0 top
U$5  74.36,92.15 0 top
U$7  21.2,18.44 0 top

### Tracks (layer width: path | path; a pad name or v marks a point on that pad's centre or on a via)
1A1M
  Top 1.27: U$2.1A 19.51,96.14 J1.3
1A2M
  Top 1.27: U$3.1A 40.69,96.08 J2.3
1A4M
  Top 1.27: U$5.1A 83.25,96.08 J4.3
1B1M
  Top 1.27: U$2.1B 22.05,96.14 J1.4
1B2M
  Top 1.27: U$3.1B 43.23,96.08 J2.4
1B3M
  Top 1.27: U$4.1B J3.4
1B4M
  Top 1.27: J4.4 85.81,93.34 U$5.1B
2A1M
  Top 1.27: U$2.2A 16.97,96.14 J1.2
2A2M
  Top 1.27: U$3.2A 38.15,96.08 J2.2
2A4M
  Top 1.27: U$5.2A 80.7,96.08 J4.2
2B1M
  Top 1.27: U$2.2B 14.43,96.14 J1.1
2B2M
  Top 1.27: U$3.2B 35.61,96.08 J2.1
2B4M
  Top 1.27: U$5.2B 78.17,96.08 J4.1
3M1A
  Top 1.27: U$4.1A J3.3
3M2A
  Top 1.27: U$4.2A J3.2
3M2B
  Top 1.27: U$4.2B J3.1
3V3  (via drill 0.6)
  Top 0.406: U1.8 90.39,72.31 90.6,72.1
  Top 0.813: C14.1 62.11,91.2 R3.1 | C12.1 R10.1 | C2.1 R1.1 | 62.9,43.7 v60.2,46.4 | R4.1
  Top 1.27: U$2.VDD C2.1 | U$3.VDD C4.1 | U$4.VDD C14.1 | U$5.VDD C12.1
  Top 1.422: C12.1 88,91.09 88,90.2 93.2,86.1 93.2,78.7 90.6,76.1 90.6,72.1 90.6,67.7 88.39,65.49 R9.1 R7.1 R5.1 R8.1 R6.1 R4.1 | R14.1 R13.1 64.86,41.74 v60.2,46.4
  Top 1.676: C24.+ 9.91,44.5 IC6.4
  Top 1.778: R4.1 70.7,68 v70.9,68.2 | v38.9,60.8 v38.9,54.8 | v10.6,46.8 10.6,45.19 9.91,44.5
  Bottom 1.778: v70.9,68.2 51.2,68.2 48.9,70.5 40.7,70.5 38.9,68.7 v38.9,60.8 | v10.6,46.8 10.6,54.4 11,54.8 v38.9,54.8 39.8,53.9 39.8,32.3 40.5,31.6 48.8,31.6 50.7,33.5 50.7,44.3 52.8,46.4 v60.2,46.4
  pour Top (isolate 0.61, rank 5, no thermals): 18.4,100 18.4,90.8 19.2,90 86.8,90 91.5,85.3 99.6,85.3 99.7,96 96.3,100
5V  (via drill 0.6)
  Top 0.406: 65.95,54.88 U$1.GND_ICSP | U$1.5V_B U$1.5V_A 93.88,75.08 92.2,73.4 92.2,53.4 v91.5,52.7 | EXP1.10
  Top 0.813: EXP1.10 78.32,49.8 76.73,51.39 69.75,51.39 67.53,53.61 67.53,54.24 66.89,54.88 65.95,54.88 | U$1.GND_ICSP 65.94,54.96 65.6,55.3 65.6,70.4 64.6,71.4 41.98,71.6 42,71.6 33,62.6 | L1.2 25.06,58.16 25.8,58.9 29.3,58.9 33,62.6 | 33,62.6 33.96,62.6 JP1.1
  Top 1.676: C25.+ 36.12,44.18 37.9,42.4 37.9,35.3 | 37.9,35.3 37.9,32 | 37.9,32 37.9,27.03 U$1.5V-P | PAD12.1 37.4,35.8 37.9,35.3 | PAD1.1 37.9,32
  Top 2.184: v21.8,47.4 21.8,46.05 IC6.3
  Bottom 0.406: v91.5,52.7 85.2,52.7 85,52.5 EXP1.10
  pour Top (isolate 0.406, rank 3, no thermals): 14.69,66.23 14.69,64.64 11.83,64.64 11.83,62.74 15.32,62.74 15.96,62.1 15.96,61.47 16.28,61.15 25.48,61.15 27.39,59.24 27.39,51.62 29.61,49.4 29.61,44.64 29.61,42.94 19.38,42.94 18.46,42.95 17.86,43.69 16.28,45.27 8.02,45.27 6.43,46.86 6.43,57.02 12.47,50.99 17.23,50.99 17.86,51.62 17.86,57.34 17.23,57.98 12.15,57.98 10.24,59.88 10.24,66.23
24V
  Top 0.305: 12.96,17.2 U$7.1@1
  Top 0.61: R19.1 12.35,16.59 U$7.1@1
  pour Bottom (isolate 0.61, rank 5, no thermals): 11.1,20.6 11.2,15.7 11.3,15.6 17.1,9.4 17.1,0.6 24.5,0.6 24.5,13.5 21.2,16.8 21.1,20.6
BEDOUT1
  Bottom 0.813: D10.A 34.3,9.49 PAD6.1
  pour Bottom (isolate 0.61, no thermals): 33.2,12.8 33.2,4.6 34.1,3.7 35.5,3.7 38.4,6.6 38.4,11.3 40,12.9 40,18.5 38.2,18.5 38.2,15.8 35.3,12.9 33.3,12.9
BEEP
  Bottom 0.406: EXP1.1 87.53,39.67 86.2,41 86.2,51.1 86.7,51.6 91.2,51.6 91.8,51.1 95.01,51.1 U$1.41
CD  (via drill 0.6)
  Top 0.406: v71.97,53.29 71.97,53.93 71.66,54.24 70.37,54.24 70.25,54.36 70.25,54.4 69.8,54.9 68.6,56.2 68.6,75.07 U$1.TX3
  Bottom 0.406: EXP2.7 74.83,48.53 74.83,50.75 74.19,51.39 72.61,51.39 71.97,52.02 v71.97,53.29
CS1  (via drill 0.6)
  Top 0.406: v70.07,53.29 69.43,53.29 68.8,53.93 68.8,54.68 67.38,56.1 67.47,70.92 65.5,72.9 54,72.9 53.2,73.7 53.2,75.15 U$1.4
  Bottom 0.406: EXP2.4 72.61,42.18 71.97,42.81 71.97,50.12 70.07,52.02 v70.07,53.29
E1-DIR
  Top 0.406: U$1.TX2 73.56,77.16 74.6,78.2 88.45,78.2 U$5.DIR
E1-EN
  Top 0.406: U$1.2 58.32,76.82 58.9,77.4 69.87,77.4 U$5.EN
E1-STEP
  Top 0.406: U$1.RX3 71.02,76.62 73.5,79.1 86.81,79.1 U$5.STEP
ENC_A
  Top 0.406: U$1.52 90.4,34.55 88.8,36.15 84.36,36.15 82.13,38.37 82.13,41.55 81.5,42.18 EXP2.3
ENC_B
  Top 0.406: U$1.50 85,37.09 83.4,38.69 83.4,44.09 82.77,44.72 EXP2.5
ENC_P
  Top 0.406: U$1.48 90.06,39.63 88.48,38.05 85.94,38.05 84.99,39.01 EXP1.2
EXTOUT
  Bottom 0.813: D11.A 49.6,9.43 PAD8.1
  pour Bottom (isolate 0.61, no thermals): 48.5,12.8 48.5,4.5 49.2,3.8 50.9,3.8 53.7,6.6 53.7,11.4 54.4,12.1 54.4,18.5 52.4,18.5 52.4,14.8 50.5,12.9 48.6,12.9
FETBED
  Top 0.406: R11.1 40.9,23.1 42.7,24.9 49.5,24.9 50.7,26.1 U$1.A0
FETE0
  Top 0.406: U$1.A1 53.24,23.16 R20.1
FETFAN
  Top 0.406: U$1.A2 55.78,25.42 56.5,24.7 66.8,24.7 67.4,24.1 67.4,23.1 R12.1
GND  (via drill 0.6, 0.8)
  Top 0.406: U$1.GND_A U$1.GND_B | U1.7 88.77,71.03 89.1,70.7 89.1,68.3 88,67.2 83.3,67.2 U1.4
  Top 0.813: C2.2 27.12,89.08 27.9,88.3 33.4,88.3 | 33.4,88.3 48.2,88.3 | 48.2,88.3 54.4,88.3 | 54.4,88.3 69.6,88.3 | 69.6,88.3 75.4,88.3 75.9,88.8 | 75.9,88.8 75.9,91 C8.2 | U$4.GND 69.49,88.41 69.6,88.3 | U$4.GND@0 54.25,88.45 54.4,88.3 | U$3.GND 48.31,88.41 48.2,88.3 | U$3.GND@0 33.07,88.63 33.4,88.3 | C8.2 76.05,88.95 75.9,88.8 | C12.2 90.85,93.31 U$5.GND | C8.2 76.05,92.89 U$5.GND@0
  Top 1.016: v80.7,52.6 80.7,56.49 C15.1 | C5.1 C7.1 C15.1 | C16.1 C11.1 C6.1 C15.1
  Top 1.27: IC3.5 18.27,63.78 20.09,65.59 | 20.09,65.59 IC3.6 | IC3.3 20.09,67.18 | 20.09,67.18 20.41,67.18 | 20.41,67.18 20.41,67.5 20.72,67.18 20.41,67.18 | 20.09,67.18 20.09,65.59 | U$2.GND@0 C1.2 | U$2.GND C2.2 | U$3.GND@0 C3.2 | U$3.GND C4.2 | U$4.GND@0 C13.2 | U$4.GND C14.2 | EXP1.9 87.53,56.34 C5.1
  Top 1.422: 19.93,39.38 IC6.1 | 23.37,68.88 IC3.6
  Bottom 0.406: U$1.GND_A 92.62,32.01 92.29,32.34 92.29,49.16 91.66,49.8 EXP1.9
  Bottom 0.813: U$5.GND@0 75.62,91.58 75.55,89.45 90.85,89.45 90.85,93.31 U$5.GND
  other vias: 21.68,67.18 90.4,48.5 71.2,71.5 29.7,40.5 30.9,40.5 32.1,40.5 33.3,40.5 34.5,40.5 34.5,39.3 33.3,39.3 32.1,39.3 30.9,39.3 29.7,39.3 61,64.1
  pour Top (isolate 0.61, rank 6, no thermals): -0.3,100.2 98.4,100.2 100.7,97.9 100.7,77 100.6,-1.2 -0.1,-1.2 -0.4,77.2 -0.4,100.1
  pour Bottom (isolate 0.61, rank 6, no thermals): -2,100.9 98.5,100.9 101.1,98.3 101.1,1.9 97.9,-1.3 2.9,-1.3 -0.9,2.5 -0.9,99.8
LCD-4
  Top 0.406: U$1.44 87.54,44.71 EXP1.5
LCD-6
  Top 0.406: U$1.46 93.87,42.17 92.61,40.91 86.26,40.91 EXP1.4
LCD-7
  Top 0.406: U$1.47 96.42,42.5 95.47,43.45 88.8,43.45 EXP1.3
MISO
  Top 0.406: EXP2.1 76.1,39.32 75.15,38.37 72.29,38.37 70.7,39.96 70.7,44.4 69.75,45.35 63.72,45.35 60.86,48.21 60.86,53.93 61.81,54.88 63.39,54.88 U$1.MISO_ICSP
MOSFETOUT
  Bottom 0.813: D5.A 64.9,9.37 PAD10.1
  pour Bottom (isolate 0.61, no thermals): 66.5,18.6 66.5,13.7 65.7,12.9 63.8,12.9 63.7,12.8 63.7,4.8 64.7,3.8 66,3.8 68.8,6.6 68.8,14.9 68.6,15.1 68.6,18.6
MOSI
  Top 0.406: EXP2.6 73.88,44.72 74.83,45.67 74.83,48.21 74.51,48.53 69.75,48.53 U$1.MOSI_ICSP 65.95,52.34 U$1.MOSI_ICSP
N$2
  Top 0.813: R17.1 R12.2 64.7,17.32 Q1.G
N$3
  Top 0.61: 11.8,84.1 11.8,83
N$4
  Top 0.61: 14.4,83 14.4,83.9
N$5
  Top 0.61: 16.8,83.9 16.9,83.9 16.9,82.9
N$6
  Top 0.61: 33.1,83.9 33,83.9 33,83
N$7
  Top 0.61: 35.6,83.8 35.6,83
N$8
  Top 0.61: 38.1,83.9 38.2,83.9 38.2,83.1
N$9
  Top 0.61: 54.2,84 54.4,84 54.4,82.7
N$10
  pour Top (isolate 0.406, rank 2, no thermals): 14.69,69.41 6.43,69.41 6.43,57.98 12.79,51.62 16.91,51.62 17.23,51.94 17.23,57.02 16.91,57.34 11.83,57.34 9.61,59.56 9.61,66.86 14.69,66.86
N$11
  Top 0.61: 56.7,84 56.9,84 56.9,82.5
N$12
  Top 0.61: 59.3,84 59.2,84 59.2,82.9
N$13
  Top 0.61: 75.5,83.9 75.6,83.9 75.6,83.1
N$14
  Top 0.61: 78.1,83.8 78.1,82.8
N$15
  Top 0.61: 80.7,83.8 80.7,82.7
N$17
  Top 0.305: PWR1.A 3.2,12.2
  Top 0.61: 3.2,12.2 R19.2
N$18
  Top 0.813: U$3.RST U$3.SLP
N$25
  Top 0.813: U$3.MS1 33.07,82.68 SJ4.2
N$26
  Top 0.813: U$2.MS1 SJ1.2
N$27
  Top 0.813: U$2.MS2 14.43,82.69 SJ2.2
N$28
  Top 0.813: U$2.MS3 16.97,82.7 SJ3.2
N$29
  Top 0.813: SJ1.1 SJ2.1 SJ3.1 19.16,84.23 R1.2
N$30
  Top 0.813: U$3.MS2 35.61,82.7 SJ5.2
N$31
  Top 0.813: U$3.MS3 38.15,82.69 SJ6.2
N$32
  Top 0.813: SJ4.1 35.61,84.22 SJ5.1 SJ6.1 40.36,84.23 R2.2
N$33
  Top 0.813: U$4.RST U$4.SLP
N$34
  Top 0.813: U$4.MS1 54.25,82.6 SJ7.2
N$35
  Top 0.813: U$2.RST U$2.SLP
N$36
  Top 0.813: U$4.MS2 56.79,82.6 SJ8.2
N$37
  Top 0.813: U$4.MS3 59.33,82.58 SJ9.2
N$38
  Top 0.813: SJ7.1 SJ8.1 SJ9.1 | SJ9.1 | SJ9.1 61.44,84.14 R3.2
N$39
  Top 0.813: U$5.RST U$5.SLP
N$40
  Top 0.813: U$5.MS1 75.62,82.6 SJ10.2
N$41
  Top 0.813: U$5.MS2 SJ11.2
N$42
  Top 0.813: U$5.MS3 SJ12.2
N$43
  Top 0.813: SJ10.1 78.12,84.13 SJ11.1 SJ12.1 82.97,84.1 R10.2
N$44
  Top 0.813: R18.2 31.65,49.27 29.3,51.62 PWR.A
N$46
  Top 0.813: R16.1 R20.2 50.6,17.22 Q5.G
N$67
  Top 0.813: R15.1 R11.2 36.4,17.22 Q3.G
RESET
  Top 0.406: EXP2.8 64.67,47.26 63.4,48.53 U$1.RESET_ICSP
SCK
  Top 0.406: EXP2.2 72.61,39.64 71.66,40.59 71.66,44.72 70.07,46.31 64.03,46.31 61.81,48.53 61.81,51.7 62.45,52.34 63.39,52.34 U$1.SCK_ICSP
SCL
  Top 0.406: U$1.SCL 86.26,74.36 84.8,72.9 84.8,70.2 85.3,69.7 87.14,69.7 U1.6
SDA
  Top 0.406: U$1.SDA 83.72,69.68 84.9,68.5 87.19,68.5 U1.5
T0
  Top 1.422: J11.2 75.71,10.28 C20.+ 75.7,17.8 78.64,20.74 U$1.A10 78.6,26.97 78.6,29.3 75.81,32.09 R14.2
T1
  Top 1.422: J12.2 C19.+ 85.1,16.89 85.1,18.1 84.8,18.4 83.3,18.4 81.18,20.52 U$1.A11 81.1,27.01 81.1,29.6 76.6,34.1 70.4,34.1 68.73,35.77 R13.2
VE
  Bottom 0.813: J6.1 47.34,57.94 47,57.6 37.3,57.6 34.8,60.1 JP1.2 | J6.1 J5.1 | J6.1 J7.1 J8.1 J9.1 J10.1
VM  (via drill 0.6)
  Top 0.305: PWR1.C 6.35,13.85 8,15.5 12.8,15.5 13.3,16 22.4,16 23.2,16.8 U$7.3@2
  Top 1.27: U$2.VMOT C1.1 | U$3.VMOT C3.1 | U$4.VMOT C13.1 | U$5.VMOT C8.1
  Bottom 0.813: 4.8,76 5.1,75.7 v3.7,74.8 4.6,73.1 4.6,58.4 5.4,57.6 33.96,57.6 JP1.3 | C18.+ 73.93,86.77 73.2,88.8 73.2,93.2 U$5.VMOT
  other vias: 4.7,74.8 5.7,74.8 6.7,74.8 7.7,74.8 7.7,73.8 7.7,72.8 7.7,71.8 7.7,70.8
  pour Bottom (isolate 0.61, rank 2, no thermals): 8.4,94.6 73.9,94.6 74.5,94 74.5,86.4 73.7,85.6 9.7,85.6 8.6,84.5 8.2,84.1 8.2,39.7 21.1,26.8 11.7,26.8 0.4,38.1 0.4,86.6
  pour Bottom (isolate 0.61, rank 2, no thermals): 21.9,21.1 21.9,16.9 25,13.8 25,1.1 25.8,0.3 71.6,0.3 71.9,0.6 71.9,20.9 70.3,22.4 32.3,22.4 30.6,24.1 27.4,24.1 25.9,25.6 25.9,28.8 22.1,32.6 15,32.6 11.4,29 9.9,29 9.9,22.2 11,21.1
  pour Top (isolate 0.61, rank 4, no thermals): 3,75.5 9.6,75.4 12,72.9 14,71 14,69.9 7.5,69.9 6.4,71 5.9,71 5.7,71.2 5.7,72.8 5.6,72.9 3,72.9
X-DIR
  Top 0.406: U$1.11 34.19,76.61 33.5,77.3 31.4,77.3 29.7,79 27.6,79 27.2,79.4 27.2,80.65 U$2.DIR
X-EN
  Top 0.406: U$1.13 29.11,76.49 28.5,77.1 24.9,77.1 22.7,79.3 10.77,79.3 U$2.EN
X-MAX  (via drill 0.6)
  Top 0.406: R8.2 v77.69,61.23 C6.2 | v58,55.2 D3.2
  Bottom 0.406: U$1.34 93.87,57.42 81.5,57.42 v77.69,61.23 75.78,63.13 68.48,63.13 64.35,59.01 61.81,59.01 59.91,57.1 59.91,55.52 59.59,55.2 v58,55.2
X-MIN  (via drill 0.6)
  Top 0.406: R9.2 v88.17,61.23 C5.2 | v58,65.99 57.27,65.99 D2.2
  Bottom 0.406: v58,65.99 83.4,65.99 v88.17,61.23 90.7,61.23 92.61,63.13 92.61,64.41 93.23,65.03 U$1.28
X-STEP
  Top 0.406: U$1.12 31.65,75.55 29.2,78 25.3,78 24.6,78.7 U$2.STEP
XMN
  Top 0.406: J5.2 44.8,68.1 46.2,69.5 51.3,69.5 52.1,68.7 52.1,65.71 D2.1
XMX
  Top 0.406: J8.2 44.8,49.3 46,50.5 49,50.5 50.3,51.8 50.3,54.4 51,55.1 51.97,55.1 D3.1
Y-DIR
  Top 0.406: U$1.7 45.62,78.03 U$3.DIR
Y-EN
  Top 0.406: U$1.9 39.27,76.73 38.6,77.4 35,77.4 34.2,78.2 32.1,78.2 30.5,79.8 30.5,80.69 U$3.EN
Y-MAX  (via drill 0.6)
  Top 0.406: R6.2 v74.19,61.23 C11.2 | v58,51.7 D6.2
  Bottom 0.406: U$1.36 93.87,54.88 91.97,54.88 90.39,56.47 78.96,56.47 v74.19,61.23 74.19,61.87 73.88,62.18 69.75,62.18 65.62,58.05 62.13,58.05 60.86,56.78 60.86,52.34 60.23,51.7 v58,51.7
Y-MIN  (via drill 0.6)
  Top 0.406: R7.2 v84.67,61.23 C7.2 | v58,62.18 D4.2
  Bottom 0.406: U$1.30 93.55,62.49 90.39,59.33 86.58,59.33 v84.67,61.23 80.86,65.04 65.94,65.04 63.08,62.18 v58,62.18
Y-STEP
  Top 0.406: U$1.8 41.81,78.61 42.6,79.4 44.45,79.4 U$3.STEP
YMN
  Top 0.406: J6.2 44.8,61.9 45.9,63 51.25,63 D4.1
YMX
  Top 0.406: J9.2 44.8,43.3 45.9,44.4 48.3,44.4 50.3,46.4 50.3,49.94 D6.1
Z-DIR
  Top 0.406: U$1.3 55.78,76.58 57.5,78.3 67.17,78.3 U$4.DIR
Z-EN
  Top 0.406: U$1.6 48.16,78.26 49.2,79.3 50.39,79.3 U$4.EN
Z-MAX  (via drill 0.6)
  Top 0.406: R4.2 v70.7,61.23 C16.2 | v58,48.21 D8.2
  Bottom 0.406: U$1.38 93.87,52.34 93.25,52.34 90.07,55.52 76.42,55.52 v70.7,61.23 66.89,57.1 62.45,57.1 61.81,56.47 61.81,49.48 60.54,48.21 v58,48.21
Z-MIN  (via drill 0.6)
  Top 0.406: R5.2 v81.18,61.23 C15.2 | v58,58.69 D7.2
  Bottom 0.406: U$1.32 92.31,58.37 84.04,58.37 v81.18,61.23 78.32,64.09 67.21,64.09 63.08,59.96 61.49,59.96 60.23,58.69 v58,58.69
Z-STEP
  Top 0.406: U$1.5 50.7,77.8 52.1,79.2 65.53,79.2 U$4.STEP
ZMN
  Top 0.406: J7.2 44.8,55.8 45.7,56.7 49.2,56.7 51.1,58.6 51.98,58.6 D7.1
ZMX
  Top 0.406: J10.2 44.8,37 45.6,37.8 46.9,37.8 49.4,40.3 49.4,43.6 52,46.2 52,48.15 D8.1
(copper drawn outside any net)
  shapes: Bottom circle x4, Top area x8, Top circle x4

### Text on the board
Top: GPLv3 2015 | Designed by | Peter van der Walt
tStop: GPLv3 2015 | Designed by | Peter van der Walt
OHSILK: X | Y | Z | E | 104 | 1K | 104 | 104 | 104 | 104 | 1K | 104 | 104 | 104 | 104 | 104 | 104 | 104 | 104 | 1K | 1K | 100 | 100 | 100 | 100 | EN | EN | EN | EN | 220 | GND | SIG | V+ | 256 | 24AA | 2596-5 | SS4 | 5V | X-MIN | 10K | 10K | 10K | 10K | 10K | 10K | END-V | Y-MIN | 104 | 104 | 104 | 104 | 104 | 104 | 24V | Z-MIN | 220 | PWR | 1K | X-MAX | 100 | 100 | Y-MAX | 1117-33 | 4K7 | GND | 5V | 4K7 | EXP2 | EXP1 | Z-MAX | GND | 5V | V+ | GND | SIG | 32BIT ATMEL SAM3X8E (Arduino Due) 3D Printer | 20A | 33K | 10R | 33K | 10R | 33K | 10R | 2K2 | 10U | 10U | + | - | THERMISTORS | BED | NOZ | GND | 24V | BED | + | - | BED | NOZ | + | - | NOZ | FAN | + | - | FAN